# EAGLE board OSHintosh (EAGLE 9.7.0), part 1 of 5
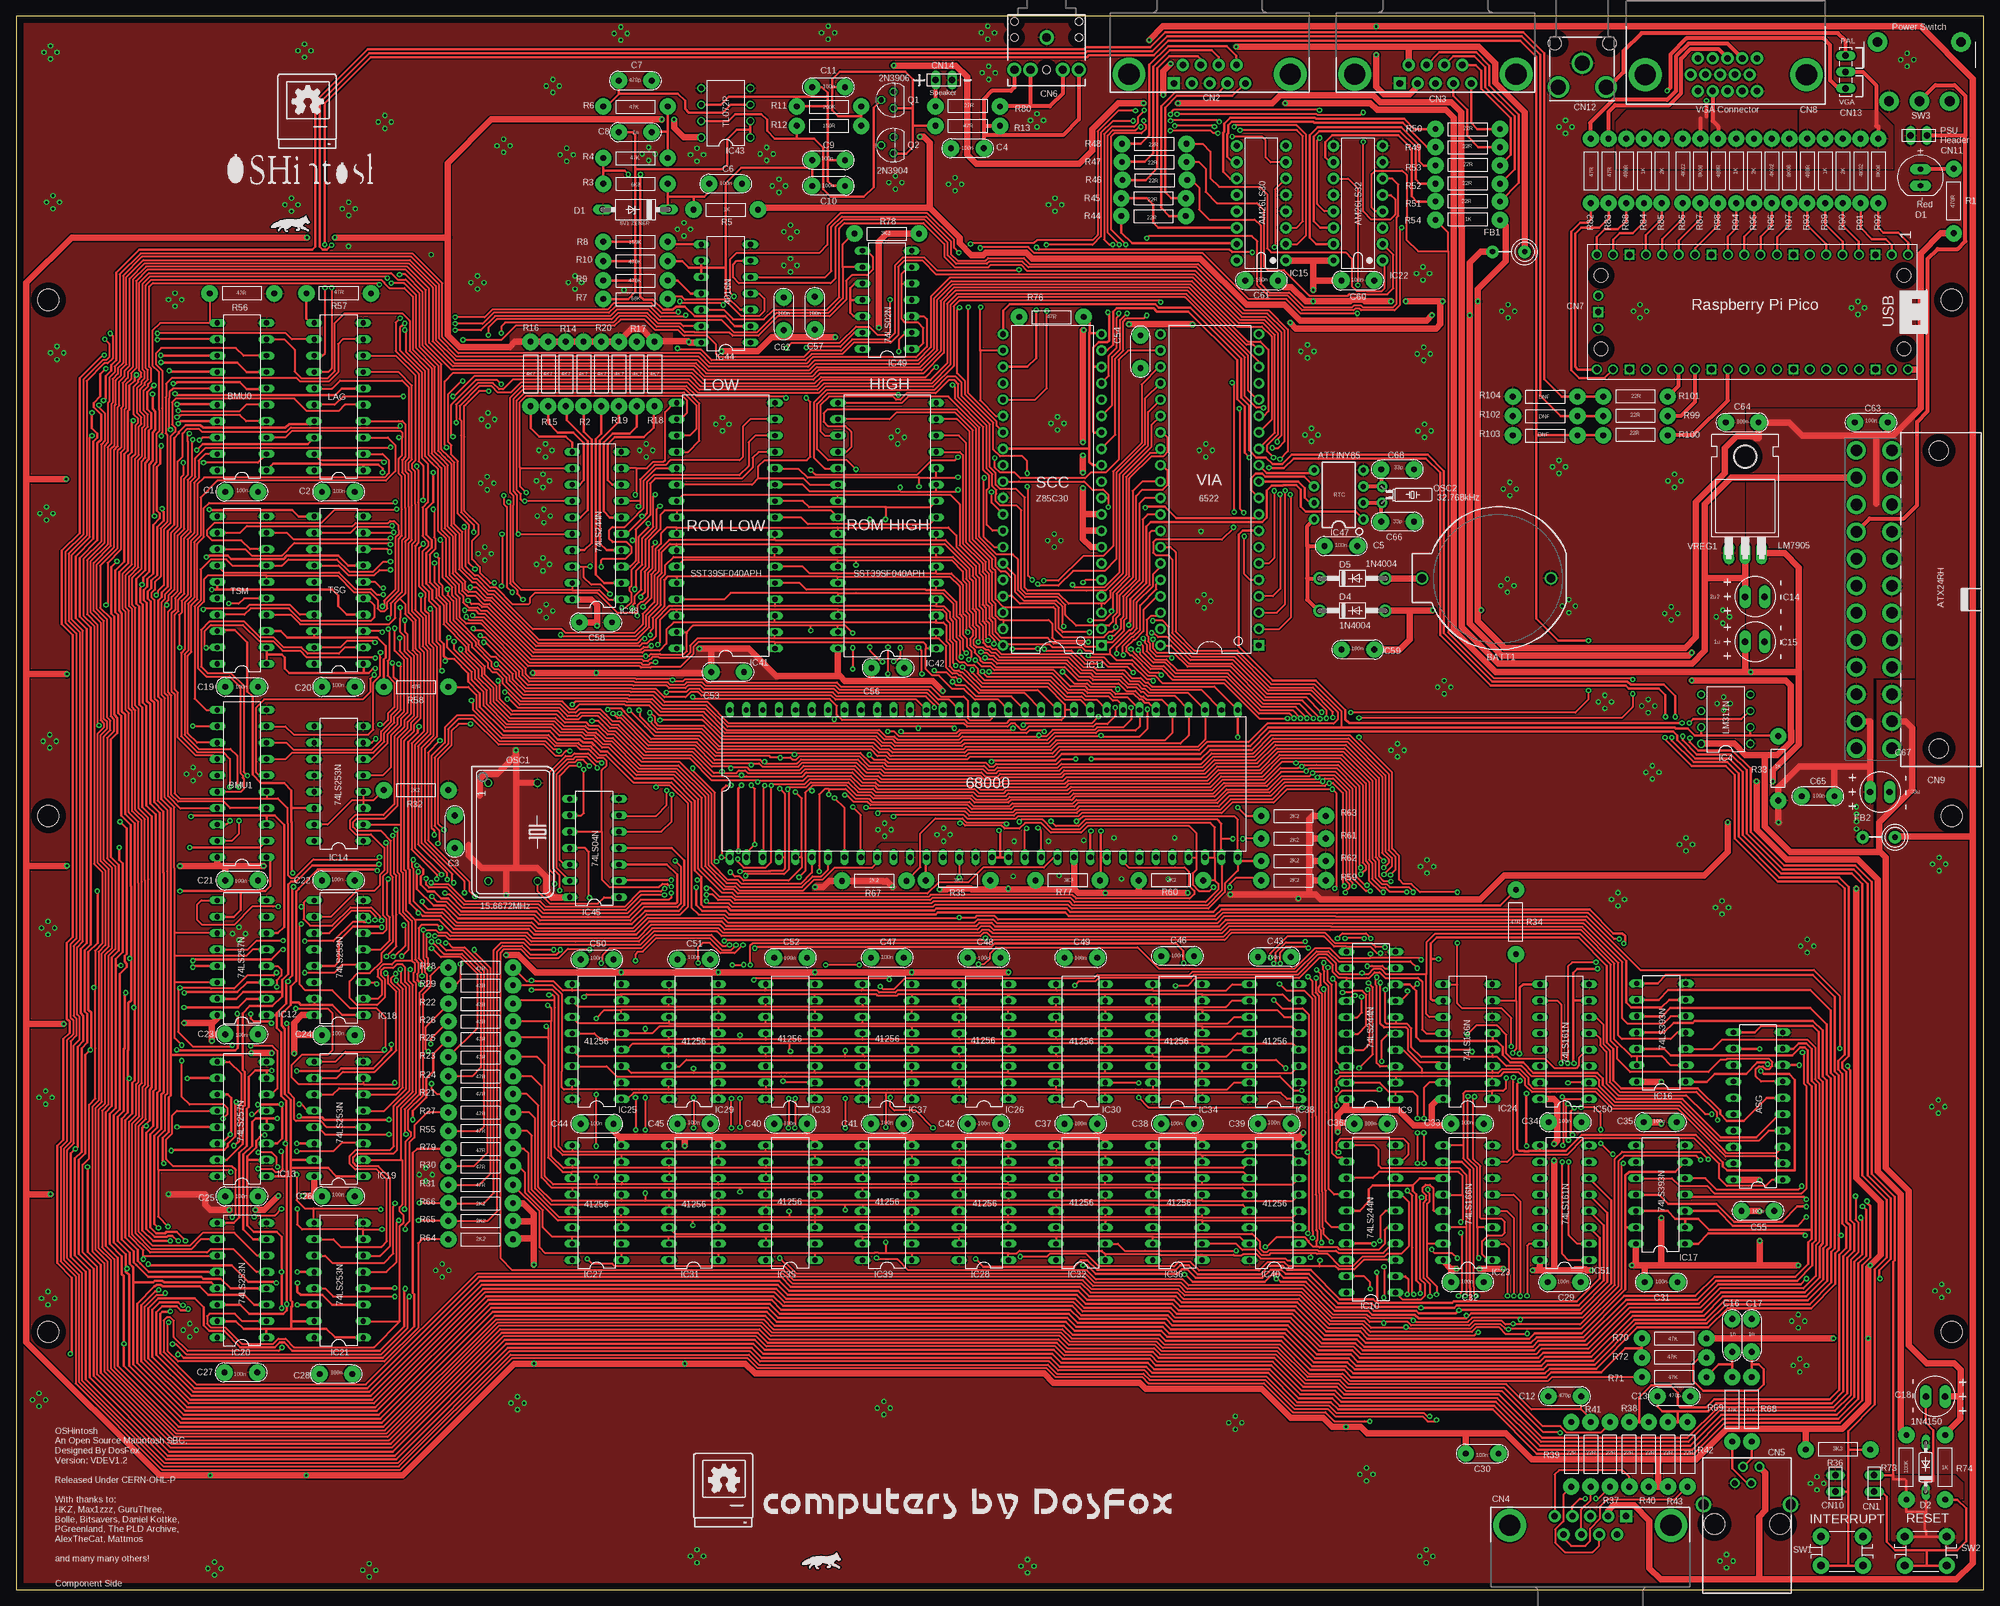
[diagram p5: board, top side]
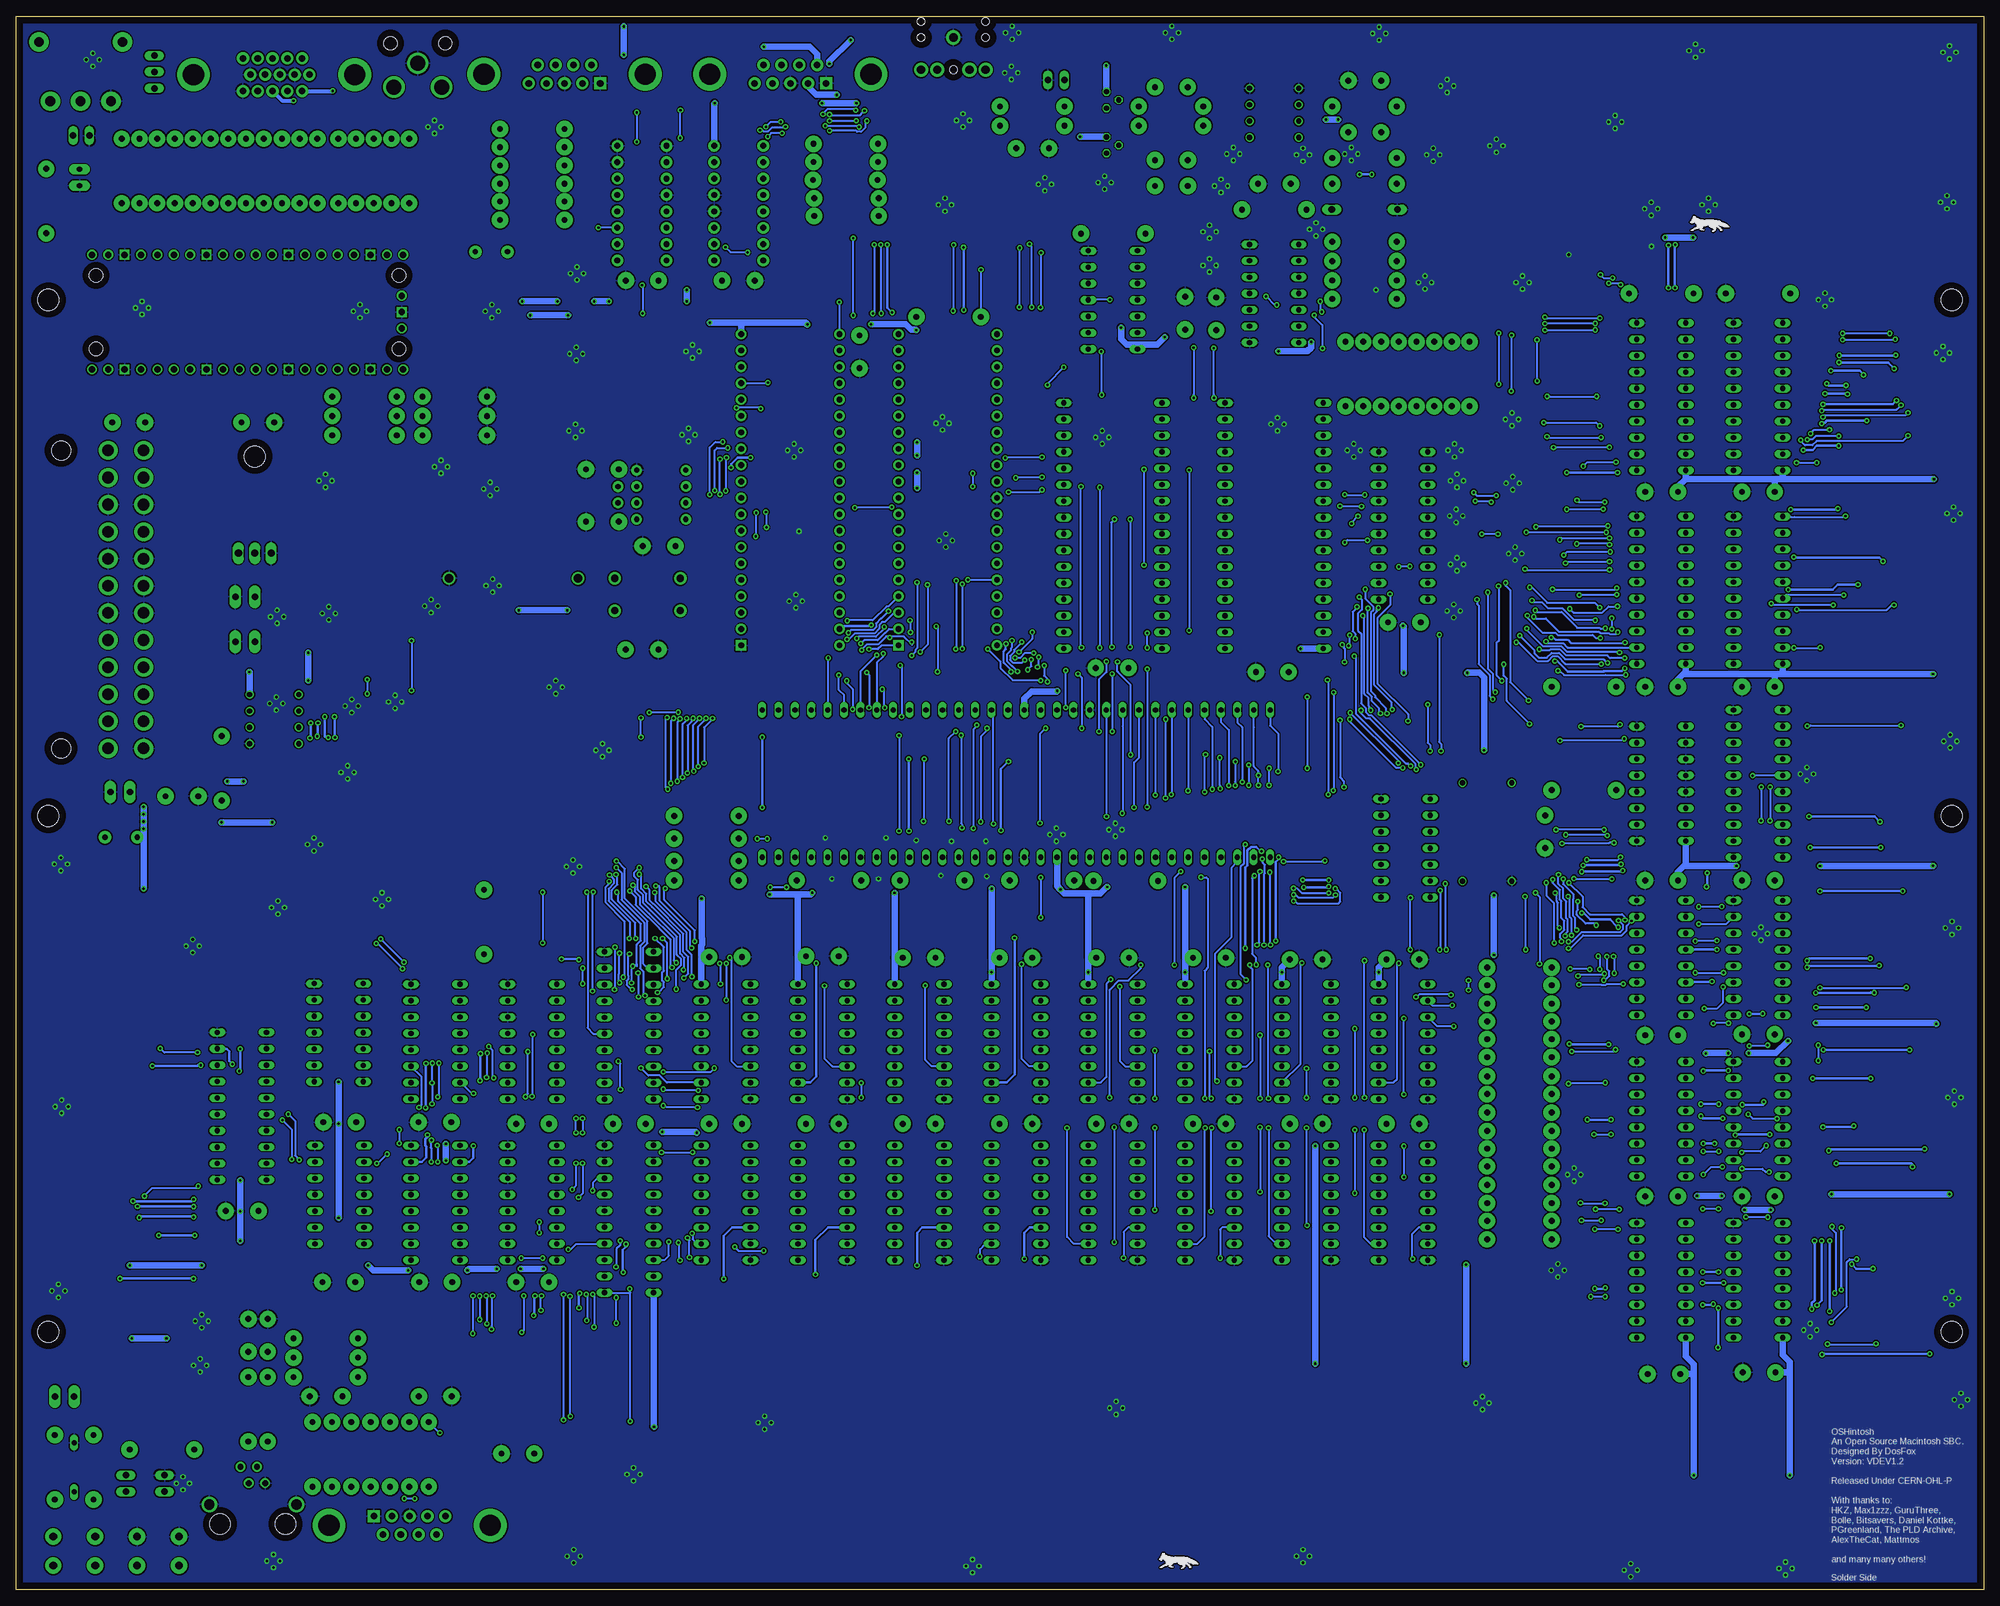
[diagram p6: board, bottom side, seen from below]

Size 305 x 244 mm. Coordinates in mm from the lower left corner, seen from the top.
Outline: 0,0 305,0 305,244 0,244 0,0
Copper layers (1*16): Top 0.035mm / dielectric 1.5mm / Bottom 0.035mm
Design rules "Fusion Electronics Design Rules *": minimum track width 0.2mm, minimum drill 0.25mm, track to track 8mil, track to pad 8mil, pad to pad 8mil, via to via 8mil, smd to smd 8mil, copper to edge 40mil, drill to drill 8mil, minimum pad ring 1mil, minimum via ring 8mil, stop-mask expansion 4mil, vias tented up to drill 1mm, thermal gap 10mil
Holes 3.3 mm at 5,200 5,120 5,40 300,40 300,120 300,200

## Footprints (pad centres in the part's own frame; a part is rotated, then mirrored left to right if it is on the bottom)
BATTCOM_20MM_PTH = drill 1.3: 1 11.85,0; 2 -8.15,0
CAP_5.08MM_PITCH = drill 0.9 pad 2.54: P$1 0,0; P$2 0,-5.08
CAP_ELECTROLYTIC = drill 1 pad 1.778 long: P$1 0,0; P$2 0,-3
2W_2.54MM_PITCH_VERT_TH = drill 1 pad 1.5 long: 1 -1.27,0; 2 1.27,0
DB9 = drill 1.016 pad 1.88 square: 1 -5.54,-1.42 | drill 1.016 pad 1.88: 2 -2.77,-1.42; 3 0,-1.42; 4 2.77,-1.42; 5 5.54,-1.42; 6 -4.15,1.42; 7 -1.38,1.42; 8 1.38,1.42; 9 4.15,1.42 | drill 3.302 pad 5.08: G1 -12.5,0; G2 12.5,0
XRJK-S-01-6-4-0-9M2 = drill 0.9 pad 1.5: 1 -1.905,6.35; 2 -0.635,8.89; 3 0.635,6.35; 4 1.905,8.89 | drill 1.6 pad 2.184: S1 -6.75,3.05; S2 6.75,3.05 | hole 3.2: -5.08,0; 5.08,0
AUDIO-JACK = drill 1.3 pad 2.184: RING 5,5; RSH 5,2.5; SLEEVE 0,0; TIP 5,-5; TSH 5,-2.5 | hole 1.2: 0,5; -2.5,5; -2.5,-5; 0,-5; 5,0
PICO_SOCKET = drill 1: P1 0,48.26; P2 0,45.72; P4 0,40.64; P5 0,38.1; P6 0,35.56; P7 0,33.02; P9 0,27.94; P10 0,25.4; P11 0,22.86; P12 0,20.32; P14 0,15.24; P15 0,12.7; P16 0,10.16; P17 0,7.62; P19 0,2.54; P20 0,0; P21 17.78,0; P22 17.78,2.54; P24 17.78,7.62; P25 17.78,10.16; P26 17.78,12.7; P27 17.78,15.24; P29 17.78,20.32; P30 17.78,22.86; P31 17.78,25.4; P32 17.78,27.94; P34 17.78,33.02; P35 17.78,35.56; P36 17.78,38.1; P37 17.78,40.64; P39 17.78,45.72; P40 17.78,48.26; P41 6.35,0.23; P43 11.43,0.23 | drill 1 square: P3 0,43.18; P8 0,30.48; P13 0,17.78; P18 0,5.08; P23 17.78,5.08; P28 17.78,17.78; P33 17.78,30.48; P38 17.78,43.18; P42 8.89,0.23 | hole 2.1: 3.19,0.63; 14.59,0.63; 14.59,47.63; 3.19,47.63
DB15 = drill 1.016 pad 1.88: 1 -4.32,-7.62; 2 -2.03,-7.62; 3 0.26,-7.62; 4 2.55,-7.62; 5 4.84,-7.62; 6 -5.46,-5.08; 7 -3.17,-5.08; 8 -0.88,-5.08; 9 1.41,-5.08; 10 3.7,-5.08; 11 -4.32,-2.54; 12 -2.03,-2.54; 13 0.26,-2.54; 14 2.55,-2.54; 15 4.84,-2.54 | drill 3.302 pad 5.08: G1 -12.5,-5.08; G2 12.5,-5.08
ATX24_RIGHT_ANGLE = drill 1.8 pad 2.9: 1 23.1,4.76; 2 18.9,4.76; 3 14.7,4.76; 4 10.5,4.76; 5 6.3,4.76; 6 2.1,4.76; 7 -2.1,4.76; 8 -6.3,4.76; 9 -10.5,4.76; 10 -14.7,4.76; 11 -18.9,4.76; 12 -23.1,4.76; 13 23.1,10.26; 14 18.9,10.26; 15 14.7,10.26; 16 10.5,10.26; 17 6.3,10.26; 18 2.1,10.26; 19 -2.1,10.26; 20 -6.3,10.26; 21 -10.5,10.26; 22 -14.7,10.26; 23 -18.9,10.26; 24 -23.1,10.26 | hole 3: -23.1,-2.54; 23.1,-2.54
RCA = drill 2.3: PIN 3.7,3.7; SHELL 0,0; SWITCH 3.7,-3.7 | hole 2.1: -3.1,4.25; -3.1,-4.25
3W_2.54MM_PITCH_VERT_TH = drill 1 long: 1 -2.54,0; 2 0,0; 3 2.54,0
F126Z10 = drill 1.016 long: A 5.08,0; C -5.08,0
DO35-7 = drill 0.813 long: A 3.81,0; C -3.81,0
5MM_TH_VERT_STANDARD = drill 0.8 pad 1.6 long: A 0,-1.27; C 0,1.27
DO41-10 = drill 1.118 pad 1.93: A 5.08,0; C -5.08,0
FB = drill 0.8 pad 1.93: P$1 -2.5,0; P$2 2.5,0
DIL64 = drill 0.813 long: 1 -39.37,-11.43; 2 -36.83,-11.43; 3 -34.29,-11.43; 4 -31.75,-11.43; 5 -29.21,-11.43; 6 -26.67,-11.43; 7 -24.13,-11.43; 8 -21.59,-11.43; 9 -19.05,-11.43; 10 -16.51,-11.43; 11 -13.97,-11.43; 12 -11.43,-11.43; 13 -8.89,-11.43; 14 -6.35,-11.43; 15 -3.81,-11.43; 16 -1.27,-11.43; 17 1.27,-11.43; 18 3.81,-11.43; 19 6.35,-11.43; 20 8.89,-11.43; 21 11.43,-11.43; 22 13.97,-11.43; 23 16.51,-11.43; 24 19.05,-11.43; 25 21.59,-11.43; 26 24.13,-11.43; 27 26.67,-11.43; 28 29.21,-11.43; 29 31.75,-11.43; 30 34.29,-11.43; 31 36.83,-11.43; 32 39.37,-11.43; 33 39.37,11.43; 34 36.83,11.43; 35 34.29,11.43; 36 31.75,11.43; 37 29.21,11.43; 38 26.67,11.43; 39 24.13,11.43; 40 21.59,11.43; 41 19.05,11.43; 42 16.51,11.43; 43 13.97,11.43; 44 11.43,11.43; 45 8.89,11.43; 46 6.35,11.43; 47 3.81,11.43; 48 1.27,11.43; 49 -1.27,11.43; 50 -3.81,11.43; 51 -6.35,11.43; 52 -8.89,11.43; 53 -11.43,11.43; 54 -13.97,11.43; 55 -16.51,11.43; 56 -19.05,11.43; 57 -21.59,11.43; 58 -24.13,11.43; 59 -26.67,11.43; 60 -29.21,11.43; 61 -31.75,11.43; 62 -34.29,11.43; 63 -36.83,11.43; 64 -39.37,11.43
DIL20 = drill 0.813 long: 1 -11.43,-3.81; 2 -8.89,-3.81; 3 -6.35,-3.81; 4 -3.81,-3.81; 5 -1.27,-3.81; 6 1.27,-3.81; 7 3.81,-3.81; 8 6.35,-3.81; 9 8.89,-3.81; 10 11.43,-3.81; 11 11.43,3.81; 12 8.89,3.81; 13 6.35,3.81; 14 3.81,3.81; 15 1.27,3.81; 16 -1.27,3.81; 17 -3.81,3.81; 18 -6.35,3.81; 19 -8.89,3.81; 20 -11.43,3.81
DIL08 = drill 0.813 pad 1.27: 1 -3.81,-3.81; 2 -1.27,-3.81; 3 1.27,-3.81; 4 3.81,-3.81; 5 3.81,3.81; 6 1.27,3.81; 7 -1.27,3.81; 8 -3.81,3.81
DIP40 = drill 0.889 pad 1.6 square: 1 -22.86,-7.62 | drill 0.889 pad 1.6: 2 -20.32,-7.62; 3 -17.78,-7.62; 4 -15.24,-7.62; 5 -12.7,-7.62; 6 -10.16,-7.62; 7 -7.62,-7.62; 8 -5.08,-7.62; 9 -2.54,-7.62; 10 0,-7.62; 11 2.54,-7.62; 12 5.08,-7.62; 13 7.62,-7.62; 14 10.16,-7.62; 15 12.7,-7.62; 16 15.24,-7.62; 17 17.78,-7.62; 18 20.32,-7.62; 19 22.86,-7.62; 20 25.4,-7.62; 21 25.4,7.62; 22 22.86,7.62; 23 20.32,7.62; 24 17.78,7.62; 25 15.24,7.62; 26 12.7,7.62; 27 10.16,7.62; 28 7.62,7.62; 29 5.08,7.62; 30 2.54,7.62; 31 0,7.62; 32 -2.54,7.62; 33 -5.08,7.62; 34 -7.62,7.62; 35 -10.16,7.62; 36 -12.7,7.62; 37 -15.24,7.62; 38 -17.78,7.62; 39 -20.32,7.62; 40 -22.86,7.62
DIL16 = drill 0.813 long: 1 -8.89,-3.81; 2 -6.35,-3.81; 3 -3.81,-3.81; 4 -1.27,-3.81; 5 1.27,-3.81; 6 3.81,-3.81; 7 6.35,-3.81; 8 8.89,-3.81; 9 8.89,3.81; 10 6.35,3.81; 11 3.81,3.81; 12 1.27,3.81; 13 -1.27,3.81; 14 -3.81,3.81; 15 -6.35,3.81; 16 -8.89,3.81
DIP16 = drill 0.9 pad 1.8: P$1 -8.89,-3.81; P$2 -6.35,-3.81; P$3 -3.81,-3.81; P$4 -1.27,-3.81; P$5 1.27,-3.81; P$6 3.81,-3.81; P$7 6.35,-3.81; P$8 8.89,-3.81; P$9 8.89,3.81; P$10 6.35,3.81; P$11 3.81,3.81; P$12 1.27,3.81; P$13 -1.27,3.81; P$14 -3.81,3.81; P$15 -6.35,3.81; P$16 -8.89,3.81
DIL14 = drill 0.813 long: 1 -7.62,-3.81; 2 -5.08,-3.81; 3 -2.54,-3.81; 4 0,-3.81; 5 2.54,-3.81; 6 5.08,-3.81; 7 7.62,-3.81; 8 7.62,3.81; 9 5.08,3.81; 10 2.54,3.81; 11 0,3.81; 12 -2.54,3.81; 13 -5.08,3.81; 14 -7.62,3.81
DIL32 = drill 0.813 long: 1 -19.05,-7.62; 2 -16.51,-7.62; 3 -13.97,-7.62; 4 -11.43,-7.62; 5 -8.89,-7.62; 6 -6.35,-7.62; 7 -3.81,-7.62; 8 -1.27,-7.62; 9 1.27,-7.62; 10 3.81,-7.62; 11 6.35,-7.62; 12 8.89,-7.62; 13 11.43,-7.62; 14 13.97,-7.62; 15 16.51,-7.62; 16 19.05,-7.62; 17 19.05,7.62; 18 16.51,7.62; 19 13.97,7.62; 20 11.43,7.62; 21 8.89,7.62; 22 6.35,7.62; 23 3.81,7.62; 24 1.27,7.62; 25 -1.27,7.62; 26 -3.81,7.62; 27 -6.35,7.62; 28 -8.89,7.62; 29 -11.43,7.62; 30 -13.97,7.62; 31 -16.51,7.62; 32 -19.05,7.62
DIP-40 = drill 0.889 pad 1.6 square: 1 -22.86,-7.62 | drill 0.889 pad 1.6: 2 -20.32,-7.62; 3 -17.78,-7.62; 4 -15.24,-7.62; 5 -12.7,-7.62; 6 -10.16,-7.62; 7 -7.62,-7.62; 8 -5.08,-7.62; 9 -2.54,-7.62; 10 0,-7.62; 11 2.54,-7.62; 12 5.08,-7.62; 13 7.62,-7.62; 14 10.16,-7.62; 15 12.7,-7.62; 16 15.24,-7.62; 17 17.78,-7.62; 18 20.32,-7.62; 19 22.86,-7.62; 20 25.4,-7.62; 21 25.4,7.62; 22 22.86,7.62; 23 20.32,7.62; 24 17.78,7.62; 25 15.24,7.62; 26 12.7,7.62; 27 10.16,7.62; 28 7.62,7.62; 29 5.08,7.62; 30 2.54,7.62; 31 0,7.62; 32 -2.54,7.62; 33 -5.08,7.62; 34 -7.62,7.62; 35 -10.16,7.62; 36 -12.7,7.62; 37 -15.24,7.62; 38 -17.78,7.62; 39 -20.32,7.62; 40 -22.86,7.62
DIP08_MCU = drill 0.813 pad 1.626: 1 -3.81,-3.81; 2 -1.27,-3.81; 3 1.27,-3.81; 4 3.81,-3.81; 5 3.81,3.81; 6 1.27,3.81; 7 -1.27,3.81; 8 -3.81,3.81
DIL14S = drill 0.813: 1 -7.62,-3.81; 7 7.62,-3.81; 8 7.62,3.81; 14 -7.62,3.81
CRYSTAL-PTH-2X6-CYL = drill 0.813 pad 1.676: 1 -1.27,0; 2 1.27,0
TO92 = drill 0.813 octagon: 1 1.27,0; 2 0,1.905; 3 -1.27,0
TO92D = drill 0.813 octagon: B 0,1.905; C 1.27,0; E -1.27,0
RESISTORTHRUHOLE = drill 0.9 pad 2.54: P$1 0,0; P$2 10,0
DIP_DTS_6_TACT_SWITCH_6X6_TH = drill 1.2 pad 2.54: P$1 -3.25,2.25; P$2 3.25,2.25; P$3 -3.25,-2.25; P$4 3.25,-2.25
THRUHOLE90DEGSLIDESW = drill 1.5 pad 3: P$1 -4.7,-4.2; P$2 0,-4.2; P$3 4.7,-4.2; P$4 -6.475,5; P$5 6.475,5
TO220H = drill 1.118 long: 1 -2.54,-10.16; 2 0,-10.16; 3 2.54,-10.16 | hole 3.302: 0,4.826

## Placement (x,y rotation side)
A1  VDEV1  [PCB_CUSTOM_DETAILS]  323.52,1.23 0 top  (outside the outline)
BATT1  [BATTCOM_20MM_PTH]  229.74,156.84 180 top
C1  100n 50V  [CAP_5.08MM_PITCH]  37.5,170.25 270 top
C2  100n 50V  [CAP_5.08MM_PITCH]  52.5,170.25 270 top
C3  100n 50V  [CAP_5.08MM_PITCH]  68,115 180 top
C4  100n 50V  [CAP_5.08MM_PITCH]  150,223.5 270 top
C5  100n 50V  [CAP_5.08MM_PITCH]  207.89,161.83 270 top
C6  100n 50V  [CAP_5.08MM_PITCH]  112.5,218 270 top
C7  470p 50V  [CAP_5.08MM_PITCH]  98.5,234 270 top
C8  1n 50V  [CAP_5.08MM_PITCH]  98.5,226 270 top
C9  100n 50V  [CAP_5.08MM_PITCH]  123.38,221.68 90 top
C10  100n 50V  [CAP_5.08MM_PITCH]  123.38,217.68 90 top
C11  220p 50V  [CAP_5.08MM_PITCH]  123.4,233 90 top
C12  470p 50V  [CAP_5.08MM_PITCH]  237.5,30 90 top
C13  470p 50V  [CAP_5.08MM_PITCH]  259.5,30 270 top
C14  2u2 50V  [CAP_ELECTROLYTIC]  268,154 90 top
C15  1u 50V  [CAP_ELECTROLYTIC]  268,147 90 top
C16  1n 50V  [CAP_5.08MM_PITCH]  266,42 0 top
C17  1n 50V  [CAP_5.08MM_PITCH]  269,42 0 top
C18  4u7 50V  [CAP_ELECTROLYTIC]  299,30 270 top
C19  100n 50V  [CAP_5.08MM_PITCH]  37.5,140 270 top
C20  100n 50V  [CAP_5.08MM_PITCH]  52.5,140 270 top
C21  100n 50V  [CAP_5.08MM_PITCH]  37.5,110 270 top
C22  100n 50V  [CAP_5.08MM_PITCH]  52.5,110 270 top
C23  100n 50V  [CAP_5.08MM_PITCH]  37.5,86.13 270 top
C24  100n 50V  [CAP_5.08MM_PITCH]  52.5,86 270 top
C25  100n 50V  [CAP_5.08MM_PITCH]  37.5,61 270 top
C26  100n 50V  [CAP_5.08MM_PITCH]  52.5,61 270 top
C27  100n 50V  [CAP_5.08MM_PITCH]  37.37,33.71 270 top
C28  100n 50V  [CAP_5.08MM_PITCH]  52.12,33.46 270 top
C29  100n 50V  [CAP_5.08MM_PITCH]  242.5,47.7 270 top
C30  100n 50V  [CAP_5.08MM_PITCH]  229.77,21.13 270 top
C31  100n 50V  [CAP_5.08MM_PITCH]  257.5,47.7 270 top
C32  100n 50V  [CAP_5.08MM_PITCH]  227.5,47.7 270 top
C33  100n 50V  [CAP_5.08MM_PITCH]  227.5,72.25 270 top
C34  100n 50V  [CAP_5.08MM_PITCH]  242.63,72.51 270 top
C35  100n 50V  [CAP_5.08MM_PITCH]  257.37,72.51 270 top
C36  100n 50V  [CAP_5.08MM_PITCH]  212.5,72.25 270 top
C37  100n 50V  [CAP_5.08MM_PITCH]  162.5,72.25 90 top
C38  100n 50V  [CAP_5.08MM_PITCH]  177.5,72.25 90 top
C39  100n 50V  [CAP_5.08MM_PITCH]  192.5,72.25 90 top
C40  100n 50V  [CAP_5.08MM_PITCH]  117.5,72.25 90 top
C41  100n 50V  [CAP_5.08MM_PITCH]  132.5,72.25 90 top
C42  100n 50V  [CAP_5.08MM_PITCH]  147.5,72.25 90 top
C43  100n 50V  [CAP_5.08MM_PITCH]  192.5,98.13 90 top
C44  100n 50V  [CAP_5.08MM_PITCH]  87.5,72.25 90 top
C45  100n 50V  [CAP_5.08MM_PITCH]  102.5,72.25 90 top
C46  100n 50V  [CAP_5.08MM_PITCH]  177.5,98.25 90 top
C47  100n 50V  [CAP_5.08MM_PITCH]  132.5,98 90 top
C48  100n 50V  [CAP_5.08MM_PITCH]  147.5,98 90 top
C49  100n 50V  [CAP_5.08MM_PITCH]  162.5,98 90 top
C50  100n 50V  [CAP_5.08MM_PITCH]  87.5,97.75 90 top
C51  100n 50V  [CAP_5.08MM_PITCH]  102.5,97.75 90 top
C52  100n 50V  [CAP_5.08MM_PITCH]  117.5,98 90 top
C53  100n 50V  [CAP_5.08MM_PITCH]  112.83,142.3 270 top
C54  100n 50V  [CAP_5.08MM_PITCH]  174.27,189.41 180 top
C55  100n 50V  [CAP_5.08MM_PITCH]  272.5,58.74 270 top
C56  100n 50V  [CAP_5.08MM_PITCH]  137.66,142.94 270 top
C57  100n 50V  [CAP_5.08MM_PITCH]  123.8,200.49 0 top
C58  100n 50V  [CAP_5.08MM_PITCH]  92.37,150 270 top
C59  100n 50V  [CAP_5.08MM_PITCH]  205.45,145.79 90 top
C60  100n 50V  [CAP_5.08MM_PITCH]  210.5,203 270 top
C61  100n 50V  [CAP_5.08MM_PITCH]  190.5,203 90 top
C62  100n 50V  [CAP_5.08MM_PITCH]  118.97,200.38 0 top
C63  100n 50V  [CAP_5.08MM_PITCH]  285,181 90 top
C64  100n 50V  [CAP_5.08MM_PITCH]  265,181 90 top
C65  100n 50V  [CAP_5.08MM_PITCH]  276.76,123.06 90 top
C66  33p  [CAP_5.08MM_PITCH]  211.58,165.61 90 top
C67  33u 16V  [CAP_ELECTROLYTIC]  287.38,123.7 90 top
C68  33p  [CAP_5.08MM_PITCH]  211.58,173.74 90 top
CN1  2way  [2W_2.54MM_PITCH_VERT_TH]  288,16.5 90 top
CN2  [DB9]  185,235 0 top
CN3  [DB9]  220,235 0 top
CN4  [DB9]  244,10 180 top
CN5  XRJK-S-01-6-4-0-9M2  [XRJK-S-01-6-4-0-9M2]  268.31,10.19 0 top
CN6  AUDIO_JACK_3.5MM_PTH  [AUDIO-JACK]  159.73,240.69 270 top
CN7  V06-1x20-SV-GF-1  [PICO_SOCKET]  245,207 270 top
CN8  DB15  [DB15]  265,240 0 top
CN9  ATX24RH  [ATX24_RIGHT_ANGLE]  295.49,153.56 90 top
CN10  2way  [2W_2.54MM_PITCH_VERT_TH]  282,16.5 90 top
CN11  2way  [2W_2.54MM_PITCH_VERT_TH]  294.91,225.48 0 top
CN12  RCA  [RCA]  242.75,236.7 270 top
CN13  V06-1x3-SV-GF-1  [3W_2.54MM_PITCH_VERT_TH]  283.58,235.34 90 top
CN14  2way  [2W_2.54MM_PITCH_VERT_TH]  143.8,234.1 180 top
D1  [F126Z10]  96,214 180 top
D2  1N4150  [DO35-7]  296,19 90 top
D3  Red  [5MM_TH_VERT_STANDARD]  295.17,218.97 180 top
D4  1N4004  [DO41-10]  207.13,151.83 0 top
D5  1N4004  [DO41-10]  207.13,156.83 0 top
FB1  FB  [FB]  231.33,207.46 0 top
FB2  FB  [FB]  288.72,116.69 0 top
IC1  [DIL64]  150,125 0 top
IC2  TSM  [DIL20]  35,155 90 top
IC3  LAG  [DIL20]  50,185 90 top
IC4  LM311N  [DIL08]  265,135 90 top
IC5  TSG  [DIL20]  50,155 90 top
IC6  ASG  [DIL20]  270,75 90 top
IC7  BMU0  [DIL20]  35,185 90 top
IC8  BMU1  [DIL20]  35,125 90 top
IC9  74LS244N  [DIL20]  210,87.49 90 top
IC10  74LS244N  [DIL20]  210,57.5 90 top
IC11  Z85C30  [DIP40]  160.6,169.3 90 top
IC12  74LS257N  [DIL16]  35,98 90 top
IC13  74LS257N  [DIL16]  35,73 90 top
IC14  74LS253N  [DIL16]  50,125 90 top
IC15  AM26LS30  [DIP16]  193,215 90 top
IC16  74LS393N  [DIL14]  255,86.4 90 top
IC17  74LS393N  [DIL14]  254.87,61.27 90 top
IC18  74LS253N  [DIL16]  50,98 90 top
IC19  74LS253N  [DIL16]  50,73 90 top
IC20  74LS253N  [DIL16]  35,48 90 top
IC21  74LS253N  [DIL16]  50,48 90 top
IC22  AM26LS32  [DIP16]  208,215 90 top
IC23  74LS166N  [DIL16]  225,60 90 top
IC24  74LS166N  [DIL16]  225,85 90 top
IC25  [DIL16]  90,85 90 top
IC26  [DIL16]  150,85 90 top
IC27  [DIL16]  90,60 90 top
IC28  [DIL16]  150,60 90 top
IC29  [DIL16]  105,85 90 top
IC30  [DIL16]  165,85 90 top
IC31  [DIL16]  105,60 90 top
IC32  [DIL16]  165,60 90 top
IC33  [DIL16]  120,85 90 top
IC34  [DIL16]  180,85 90 top
IC35  [DIL16]  120,60 90 top
IC36  [DIL16]  180,60 90 top
IC37  [DIL16]  135,85 90 top
IC38  [DIL16]  195,85 90 top
IC39  [DIL16]  135,60 90 top
IC40  [DIL16]  195,60 90 top
IC41  SST39SF040APH  [DIL32]  110,165 90 top
IC42  SST39SF040APH  [DIL32]  135,165 90 top
IC43  TL072P  [DIL08]  110,229 90 top
IC44  4016N  [DIL14]  110,201 90 top
IC45  74LS04N  [DIL14]  89.62,115 90 top
IC46  6522  [DIP-40]  185,169.3 90 top
IC47  ATTINY85  [DIP08_MCU]  205,169.8 90 top
IC48  74LS244N  [DIL20]  90,165 90 top
IC49  74LS02N  [DIL14]  135,200 90 top
IC50  74LS161N  [DIL16]  240,85 90 top
IC51  74LS161N  [DIL16]  240,60 90 top
OSC1  15.6672MHz  [DIL14S]  77,117.5 270 top
OSC2  32.768kHz  [CRYSTAL-PTH-2X6-CYL]  211.71,169.8 270 top
Q1  2N3906  [TO92]  136,231 90 top
Q2  2N3904  [TO92D]  136,224 90 top
R1  470R  [RESISTORTHRUHOLE]  300.33,220.32 270 top
R2  4k7  [RESISTORTHRUHOLE]  87.94,183.51 90 top
R3  6k8  [RESISTORTHRUHOLE]  91,218 0 top
R4  47k  [RESISTORTHRUHOLE]  91,222 0 top
R5  1k  [RESISTORTHRUHOLE]  105,214 0 top
R6  47k  [RESISTORTHRUHOLE]  91,230 0 top
R7  68k  [RESISTORTHRUHOLE]  91,200.14 0 top
R8  150k  [RESISTORTHRUHOLE]  91,209.02 0 top
R9  470k  [RESISTORTHRUHOLE]  91,203.02 0 top
R10  470k  [RESISTORTHRUHOLE]  91,206.02 0 top
R11  200k  [RESISTORTHRUHOLE]  121,230 0 top
R12  150R  [RESISTORTHRUHOLE]  121,227 0 top
R13  27R  [RESISTORTHRUHOLE]  152.5,230 180 top
R14  4k7  [RESISTORTHRUHOLE]  85.2,183.51 90 top
R15  4k7  [RESISTORTHRUHOLE]  82.46,183.51 90 top
R16  4k7  [RESISTORTHRUHOLE]  79.71,183.51 90 top
R17  4k7  [RESISTORTHRUHOLE]  98.93,183.51 90 top
R18  4k7  [RESISTORTHRUHOLE]  96.19,183.51 90 top
R19  4k7  [RESISTORTHRUHOLE]  93.43,183.51 90 top
R20  4k7  [RESISTORTHRUHOLE]  90.69,183.51 90 top
R21  47R  [RESISTORTHRUHOLE]  67,76.88 0 top
R22  47R  [RESISTORTHRUHOLE]  67,90.87 0 top
R23  47R  [RESISTORTHRUHOLE]  67,82.59 0 top
R24  47R  [RESISTORTHRUHOLE]  67,79.62 0 top
R25  47R  [RESISTORTHRUHOLE]  67,85.39 0 top
R26  47R  [RESISTORTHRUHOLE]  67,88.13 0 top
R27  47R  [RESISTORTHRUHOLE]  67,74.01 0 top
R28  47R  [RESISTORTHRUHOLE]  67,96.49 0 top
R29  47R  [RESISTORTHRUHOLE]  67,93.74 0 top
R30  47R  [RESISTORTHRUHOLE]  67,65.66 0 top
R31  47R  [RESISTORTHRUHOLE]  67,62.79 0 top
R32  2k2  [RESISTORTHRUHOLE]  57,124 0 top
R33  1k  [RESISTORTHRUHOLE]  273.13,132.37 270 top
R34  47R  [RESISTORTHRUHOLE]  232.48,108.55 270 top
R35  3k3  [RESISTORTHRUHOLE]  141,110 0 top
R36  3k3  [RESISTORTHRUHOLE]  287.4,21.74 180 top
R37  22R  [RESISTORTHRUHOLE]  247.05,26 270 top
R38  22R  [RESISTORTHRUHOLE]  250.05,26 270 top
R39  22R  [RESISTORTHRUHOLE]  241.05,16 90 top
R40  3k3  [RESISTORTHRUHOLE]  253.05,26 270 top
R41  22R  [RESISTORTHRUHOLE]  244.05,16 90 top
R42  22R  [RESISTORTHRUHOLE]  259.05,16 90 top
R43  3k3  [RESISTORTHRUHOLE]  256.05,26 270 top
R44  22R  [RESISTORTHRUHOLE]  171.3,213.01 0 top
R45  22R  [RESISTORTHRUHOLE]  171.3,215.76 0 top
R46  22R  [RESISTORTHRUHOLE]  171.5,218.6 0 top
R47  22R  [RESISTORTHRUHOLE]  171.4,221.4 0 top
R48  22R  [RESISTORTHRUHOLE]  171.4,224.2 0 top
R49  22R  [RESISTORTHRUHOLE]  220,223.7 0 top
R50  22R  [RESISTORTHRUHOLE]  220,226.5 0 top
R51  22R  [RESISTORTHRUHOLE]  230,215.26 180 top
R52  22R  [RESISTORTHRUHOLE]  230,218 180 top
R53  22R  [RESISTORTHRUHOLE]  230,220.84 180 top
R54  1k  [RESISTORTHRUHOLE]  230,212.4 180 top
R55  47R  [RESISTORTHRUHOLE]  67,71.14 0 top
R56  47R  [RESISTORTHRUHOLE]  40,201 180 top
R57  47R  [RESISTORTHRUHOLE]  55,201 180 top
R58  47R  [RESISTORTHRUHOLE]  57,140 0 top
R59  2k2  [RESISTORTHRUHOLE]  193,110 0 top
R60  2k2  [RESISTORTHRUHOLE]  184,110 180 top
R61  2k2  [RESISTORTHRUHOLE]  193,116.48 0 top
R62  2k2  [RESISTORTHRUHOLE]  193,113 0 top
R63  2k2  [RESISTORTHRUHOLE]  193,120 0 top
R64  2k2  [RESISTORTHRUHOLE]  67,54.34 0 top
R65  2k2  [RESISTORTHRUHOLE]  67,57.21 0 top
R66  2k2  [RESISTORTHRUHOLE]  67,59.95 0 top
R67  2k2  [RESISTORTHRUHOLE]  138.01,109.93 180 top
R68  22R  [RESISTORTHRUHOLE]  269,33 270 top
R69  22R  [RESISTORTHRUHOLE]  266,33 270 top
R70  47k  [RESISTORTHRUHOLE]  252,39 0 top
R71  680R  [RESISTORTHRUHOLE]  262,36 180 top
R72  75R  [RESISTORTHRUHOLE]  252,33 0 top
R73  100k  [RESISTORTHRUHOLE]  293,24 270 top
R74  1k  [RESISTORTHRUHOLE]  299,24 270 top
R76  47R  [RESISTORTHRUHOLE]  155.47,197.37 0 top
R77  3k3  [RESISTORTHRUHOLE]  168,110 180 top
R78  3k3  [RESISTORTHRUHOLE]  129.96,210.29 0 top
R79  47R  [RESISTORTHRUHOLE]  67,68.4 0 top
R80  47R  [RESISTORTHRUHOLE]  142.5,227 0 top
R82  47R  [RESISTORTHRUHOLE]  244.08,215 90 top
R83  47R  [RESISTORTHRUHOLE]  246.83,215 90 top
R84  1k  [RESISTORTHRUHOLE]  252.31,215 90 top
R85  2k  [RESISTORTHRUHOLE]  255.06,215 90 top
R86  4k02  [RESISTORTHRUHOLE]  258.31,215 90 top
R87  8k06  [RESISTORTHRUHOLE]  261.06,215 90 top
R88  499R  [RESISTORTHRUHOLE]  249.57,215 90 top
R89  1k  [RESISTORTHRUHOLE]  280.4,215 90 top
R90  2k  [RESISTORTHRUHOLE]  283.14,215 90 top
R91  4k02  [RESISTORTHRUHOLE]  285.89,215 90 top
R92  8k06  [RESISTORTHRUHOLE]  288.63,215 90 top
R93  499R  [RESISTORTHRUHOLE]  277.6,215 90 top
R94  1k  [RESISTORTHRUHOLE]  266.63,215 90 top
R95  2k  [RESISTORTHRUHOLE]  269.37,215 90 top
R96  4k02  [RESISTORTHRUHOLE]  272.11,215 90 top
R97  8k06  [RESISTORTHRUHOLE]  274.86,215 90 top
R98  499R  [RESISTORTHRUHOLE]  263.8,215 90 top
R99  22R  [RESISTORTHRUHOLE]  256,182 180 top
R100  22R  [RESISTORTHRUHOLE]  256,179 180 top
R101  22R  [RESISTORTHRUHOLE]  256,185 180 top
R102  DNF  [RESISTORTHRUHOLE]  232,182 0 top
R103  DNF  [RESISTORTHRUHOLE]  232,179 0 top
R104  DNF  [RESISTORTHRUHOLE]  232,185 0 top
SW1  DTS-61  [DIP_DTS_6_TACT_SWITCH_6X6_TH]  283,6 0 top
SW2  DTS-61  [DIP_DTS_6_TACT_SWITCH_6X6_TH]  296,6 0 top
SW3  SS12D16-GDN5  [THRUHOLE90DEGSLIDESW]  295,235 0 top
VREG1  LM7905  [TO220H]  268,170.89 0 top

## Tracks (layer width: path | path; a pad name or v marks a point on that pad's centre or on a via)
!A20  (via drill 0.35 pad 0.8)
  Top 0.305: IC46.24 174.96,184.66 174.96,177.61 170.53,173.19 170.53,159.82 168.7,157.98 163.83,157.98 161.54,155.7 158.62,155.7 v158.37,155.95 | v158.37,145.92 158.32,145.87 v154.38,145.87 | v142.32,136.8 142.32,137.19 141,138.51 127.22,138.51 126.59,139.15 106.45,139.15 105.91,139.69 104.35,139.69 103.87,139.21 100.86,139.21 v100.79,139.14 | IC45.6 93.49,120.02 99.19,120.02 100.84,121.67 v100.84,123.94 | v142.32,142.52 142.57,142.27 144.2,142.27 144.92,141.55 145.62,141.55 v146.19,140.98 | v100.84,123.94
  Bottom 0.305: v142.32,136.8 142.32,142.06 v142.32,142.52 | v158.37,155.95 v158.37,145.92 | v146.19,140.98 146.24,141.03 150.55,141.03 152.46,142.94 152.46,143.95 v154.38,145.87 | v100.79,139.14 100.79,124.17 100.84,124.12 v100.84,123.94
!AS  (via drill 0.35 pad 0.8)
  Top 0.305: IC8.11 29.43,136.43 27.67,138.19 27.67,152.47 28.6,153.4 28.6,158.19 30.18,159.78 32.58,159.78 33.6,158.76 38.76,158.76 IC2.7 41.22,158.81 42.19,159.78 49.73,159.78 51.66,157.84 55.33,157.84 56.9,159.41 v58.03,159.41 | IC1.6 123.33,111.2 121.59,109.47 112.49,109.47 111.86,110.09 110.33,110.09 107.8,112.62 107.8,123.41 102.85,128.35 96.96,128.35 92.72,132.6 91.67,132.6 90.65,133.62 90.64,133.62 90.3,133.96 88.94,133.96 88.44,134.47 85.06,134.47 83.81,135.71 76.71,135.71 74.49,137.94 74.49,140.08 72.66,141.91 72.66,143.18 70.19,145.64 70.19,146.5 66.75,149.94 66.75,152.89 65.59,154.05 65.59,155.46 64.86,156.18 v64.86,159.2 v64.86,159.21
  Bottom 0.305: v58.03,159.41 64.56,159.41 64.76,159.21 v64.86,159.21
!C16M
  Top 0.305: IC45.1 91.14,107.38 90.18,106.42 82.74,106.42 80.79,108.36 80.81,109.12 OSC1.8
!DMA  (via drill 0.35 pad 0.8)
  Top 0.406: IC12.15 34.15,91.65 35.17,92.67 41.09,92.67 41.22,92.53 | IC13.15 31.21,66.67 32.67,66.67 35.11,69.11 35.11,74.79 35.44,75.12 35.44,80.28 35.1,80.63 35.1,82.91 | 35.1,82.91 24,82.91 | IC3.17 45.77,180.77 42.34,180.77 41.74,180.17 28.98,180.17 28.57,180.58 26.31,180.58 25.23,179.5 25.23,179.32 24.48,178.57 24.48,165.14 23.47,164.13 23.47,155.53 22.54,154.6 22.54,153.9 22,153.35 22,138.52 22.49,138.03 22.49,122.61 23.96,121.14 23.96,111.68 24,111.64 24,82.91 | v283.88,81.24 284.07,81.04 284.07,80.76 284.3,80.53 284.3,57.34 284.91,56.73 284.91,52.54 283.82,51.45 283.82,30.5 281.66,28.33 263.79,28.33 259.01,23.55 236.57,23.55 229.84,30.29 205.88,30.29 204.73,31.44 199.52,31.44 195.01,35.95 177.1,35.95 176.14,36.91 162.72,36.91 161.32,38.31 116.53,38.31 114.98,39.85 75.25,39.85 58.03,22.64 24.14,22.64 13.13,33.65 13.13,50.39 11.12,52.41 11.12,65.53 v11.06,65.59 | IC6.8 v276.37,81.35 | 35.1,82.91 35.1,89.38 36.22,90.5 39.71,90.5 41.22,92.02 41.22,92.53 | 41.22,92.53 41.22,94.53 42.19,95.5 42.19,100.99 42.18,101 42.18,109.35 42.66,109.82 43.43,109.82 45.92,112.31 56.05,112.31 v56.25,112.51 | 24,82.91 24,76.69 23.62,76.31 23.62,70.97 22.73,70.08 22.73,66.11 v22.87,66.11 | IC45.3 100.88,112.46 102.46,110.88 102.46,106.61 102.26,106.41 97.04,106.41 94.96,104.33 81.44,104.33 80.6,105.17 69,105.17 66.95,107.22 65.87,107.22 64.78,108.31 63.77,108.31 62.74,109.35 62.74,110.61 63.12,110.99 63.12,111.66 62.45,112.33 v62.12,112.33
  Bottom 0.406: v283.88,81.24 276.89,81.24 276.78,81.35 v276.37,81.35 | v22.87,66.11 11.23,66.11 11.1,65.97 11.1,65.63 v11.06,65.59 | v56.25,112.51 56.4,112.36 62.09,112.36 v62.12,112.33
!DMALD  (via drill 0.35 pad 0.8)
  Top 0.406: v270.26,83.88 270.25,83.89 IC6.12 | IC50.9 233.59,93.89 233.06,93.36 233.06,83.66 233.03,83.62 v233.03,83.13 | 236.19,68.03 IC51.9 | v233.1,78.93 232.64,78.47 232.64,68.35 232.96,68.03 233.77,68.03 233.79,68.01 234.46,68.01 234.47,68.03 236.19,68.03 | 236.19,68.03 240.18,68.03 242.67,70.52 260.35,70.52 264.56,66.31 264.56,65.69 265.23,65.02 275.72,65.02 275.72,79.06 274.82,79.96 270.9,79.96 v270.42,80.43
  Bottom 0.406: v233.03,83.13 233.03,79.13 233.1,79.06 v233.1,78.93 | v270.42,80.43 270.26,80.6 v270.26,83.88
!DTACK  (via drill 0.35 pad 0.8)
  Top 0.305: IC7.19 29.33,176.11 28.29,175.06 28.29,172.35 27.58,171.64 27.58,163.86 26.57,162.84 26.57,154.24 25.64,153.32 25.64,151.52 25.27,151.16 25.27,146.17 v25.34,146.1 | 29.21,146.11 IC2.19 | v55.67,144.46 55.49,144.64 44.97,144.64 44.01,145.6 41.29,145.6 39.82,147.07 37.69,147.07 35.15,149.62 30.18,149.62 29.21,148.65 29.21,146.11 | 29.21,146.11 29.27,146.05 v29.45,146.05 | IC1.10 133.49,112.78 132.71,112 126.88,112 124.99,110.11 123.67,110.11 122.02,108.45 112.07,108.45 111.44,109.07 109.91,109.07 106.78,112.2 106.78,122.99 102.43,127.34 96.54,127.34 92.3,131.58 91.25,131.58 90.23,132.6 90.22,132.6 89.88,132.94 88.52,132.94 88.02,133.45 84.64,133.45 83.39,134.7 76.29,134.7 73.47,137.52 73.47,139.66 71.64,141.49 71.64,142.75 68.93,145.47 v68.93,145.82
  Bottom 0.305: v55.67,144.46 57.97,144.46 58.37,144.86 64.74,144.86 65.64,145.76 67.23,145.76 67.35,145.64 68.75,145.64 v68.93,145.82 | v29.45,146.05 25.39,146.05 v25.34,146.1
!HSYNC  (via drill 0.35 pad 0.8)
  Top 0.305: IC3.14 48.35,188.81 48.9,189.36 v48.9,201.87
  Top 0.406: R99.P$2 R102.P$2 239.39,182 236.25,185.14 236.25,237.98 233.35,240.88 178.39,240.88 176.07,238.56 166.03,238.56 165.73,238.26 54.75,238.26 47.03,230.54 47.03,208.23 47.5,207.76 48.17,207.76 48.65,208.23 48.65,208.25 v48.9,208.5
  Bottom 0.406: v48.9,201.87 v48.9,208.5
!IPL0  (via drill 0.35 pad 0.8)
  Top 0.305: IC5.19 50.25,146.11 51.22,147.07 55.38,147.07 55.59,146.87 v55.63,146.87 | v67.05,147.63 67.05,147.56 66.86,147.37 66.86,146.1 70.62,142.33 70.62,141.07 72.45,139.23 72.45,137.1 75.87,133.68 82.97,133.68 84.22,132.43 87.59,132.43 88.1,131.93 89.46,131.93 89.8,131.58 89.81,131.58 90.82,130.57 91.88,130.57 96.12,126.32 102.01,126.32 105.77,122.57 105.77,111.78 109.49,108.06 111.02,108.06 111.65,107.44 141.45,107.44 141.76,107.74 163.7,107.74 164.29,107.16 181.91,107.16 182.63,107.87 182.63,108.36 181.74,109.25 181.74,111.38 181.1,112.01 179.63,112.01 179.61,112 172.46,112 171.59,112.86 IC1.25
  Bottom 0.305: v55.63,146.87 55.57,146.81 64.01,146.81 64.51,147.31 66.39,147.31 66.71,147.63 v67.05,147.63
!IPL1  (via drill 0.35 pad 0.8)
  Top 0.305: v175.34,136.53 175.39,136.48 175.39,133.55 174.15,132.31 168.15,132.31 | v165.35,156.2 165.74,156.58 168.2,156.58 IC11.5 | v166.17,144.86 166.41,144.61 168.55,144.61 169.55,143.61 172.81,143.61 173,143.42 173.01,143.42 175.22,141.22 175.97,141.22 v176.26,140.93 | v57.92,160.95 57.52,161.35 IC5.8 | 168.15,132.31 v168.15,132.46 | 168.15,132.31 161.09,132.31 160,131.23 155.83,131.23 147.01,131.23 146.58,130.8 136.22,130.8 135.71,131.31 134.35,131.31 133.35,132.31 109.65,132.31 106.37,135.59 99.68,135.59 98.14,137.13 94.45,137.13 94.35,137.24 87.27,137.24 86.53,136.5 85.9,136.5 84.65,137.75 78.25,137.75 75.46,140.54 75.46,141.27 74.49,142.25 73.9,142.25 73.16,142.99 73.16,143.7 70.7,146.17 70.7,146.71 67.26,150.15 67.26,153.1 66.1,154.26 66.1,155.66 65.61,156.15 65.61,159.93 v65.1,160.44
  Top 0.406: IC1.24 168.11,113.57 | 168.11,113.57 168.11,110.27 R77.P$1 | 168.11,113.57 168.11,117.61 v168.15,117.65
  Bottom 0.305: v175.34,136.53 175.34,139.66 176.26,140.57 v176.26,140.93 | v165.35,156.2 165.35,145.99 165.61,145.74 165.61,145.41 v166.17,144.86 | v57.92,160.95 64.6,160.95 v65.1,160.44 | v168.15,132.46 v168.15,117.65
!IPL2  (via drill 0.35 pad 0.8)
  Top 0.406: SW1.P$4 283.95,3.75 | 283.95,3.75 SW1.P$3 | R36.P$1 283.95,21.74 | 283.95,21.74 283.95,15.22 | 283.95,15.22 283.95,3.75 | 283.95,21.74 283.95,24.59 288.09,28.73 288.09,49.69 289.97,51.56 289.97,60.45 286.16,64.26 286.16,109.47 284.55,111.08 273.56,111.08 267.61,117.03 267.61,126.83 265.51,128.93 260.25,128.93 257.44,131.74 257.44,132.5 256.87,133.07 194.35,133.07 191.52,130.25 185.07,130.25 183.64,128.82 183.64,128.81 v166.63,128.81 | IC1.23 166.51,117.55 v166.61,117.65 | 283.95,15.22 CN10.1
  Bottom 0.406: v166.63,128.81 166.61,128.79 v166.61,117.65
!IWM  (via drill 0.35 pad 0.8)
  Top 0.305: IC49.3 140.72,197.46 141.15,197.03 141.15,192.74 139.52,191.11 123.5,191.11 122.53,190.14 107.6,190.14 106.01,191.74 68.53,191.74 66.06,194.21 66.06,202.59 61.45,207.2 19.3,207.2 16.06,203.96 16.06,190.44 15.28,189.66 15.28,188.78 14.46,187.96 14.46,184.26 14.24,184.03 14.24,177.94 13.66,177.36 13.66,162.3 10.99,159.63 10.99,151.25 12.6,149.65 12.6,134.28 v12.85,134.03 | IC8.12 27.39,133.89 v27.36,133.91
  Bottom 0.305: v12.85,134.03 26.85,134.03 26.97,133.91 v27.36,133.91
!LDPS  (via drill 0.35 pad 0.8)
  Top 0.305: IC24.15 219.03,78.65 218.21,77.83 v218.21,73.1 v218.22,73.09 | IC23.15 218.69,53.65 | IC3.12 42.75,193.89 41.78,194.85 21.93,194.85 v21.89,194.82 | v220.15,26.34 219.94,26.12 218.78,26.12 218.02,26.89 204.47,26.89 203.32,28.04 198.11,28.04 193.6,32.54 175.69,32.54 174.73,33.5 161.31,33.5 159.91,34.91 115.12,34.91 113.57,36.45 76.66,36.45 59.34,19.13 22.81,19.13 9.73,32.22 9.73,48.84 7.42,51.15 7.42,68.39 8.46,69.44 8.46,85.03 9.35,85.92 9.35,88.58 8.93,89 8.93,99.82 9.86,100.75 9.86,148.51 8.15,150.22 8.15,160.67 10.92,163.44 10.92,187.42 13.67,190.16 14.2,190.16 14.94,190.91 14.94,194.45 v14.57,194.82 | v218.22,66.14 v218.22,70.87 | v220.17,45.79 220.17,47.08 218.66,48.58 218.66,53.62 218.69,53.65 | 218.69,53.65 218.69,59.85 219.11,60.26 219.11,61.41 218.8,61.71 v218.8,62.06
  Bottom 0.305: v220.15,26.34 v220.16,26.35 v220.16,45.78 v220.17,45.79 | v218.22,70.87 v218.22,73.09 | v218.8,62.06 218.22,62.64 v218.22,66.14 | v21.89,194.82 v14.57,194.82
!LDS  (via drill 0.35 pad 0.8)
  Top 0.305: IC11.35 154.81,157.31 154.81,154.76 156.17,153.41 161.21,153.41 162.12,152.5 162.12,149.63 v162.37,149.38 | v170.38,136.78 170.38,135.45 169.15,134.23 167.33,134.23 166.94,133.84 156.93,133.84 156.43,133.34 155.81,133.34 155.36,133.79 155.36,133.8 154.82,134.35 154.18,134.35 153.67,133.84 147.4,133.84 146.89,134.35 126.82,134.35 | IC2.9 41.98,163.89 42.94,162.93 57.88,162.93 v58.02,163.07 | v170.74,139.62 170.32,140.04 166.5,140.04 165.99,140.54 164,140.54 162.22,142.33 v162.18,142.33 | 126.82,134.35 v126.82,134.98 | IC1.8 128.41,121.21 v126.84,122.78 | 126.82,134.35 110.49,134.35 107.21,137.63 100.52,137.63 98.98,139.16 95.3,139.16 95.19,139.27 78.89,139.27 76.99,141.17 76.99,142.02 74.36,144.64 73.66,144.64 71.72,146.59 71.72,147.13 68.28,150.57 68.28,153.52 67.61,154.19 67.61,155.46 66.12,156.95 66.12,162.4 v65.73,162.79
  Bottom 0.305: v170.38,136.78 170.54,136.94 170.54,139.42 v170.74,139.62 | v162.37,149.38 162.18,149.19 v162.18,142.33 | v126.84,122.78 126.82,122.8 v126.82,134.98 | v65.73,162.79 65.45,163.07 v58.02,163.07
!MSE.SW  (via drill 0.35 pad 0.8)
  Top 0.305: IC46.13 195.11,179.41 195.11,194.57 193.31,196.36 189.52,196.36 182.45,203.44 144.74,203.44 141.77,200.47 141.77,192.65 139.73,190.6 123.71,190.6 122.75,189.64 107.39,189.64 105.8,191.23 68.32,191.23 65.56,194 65.56,202.38 61.24,206.69 19.51,206.69 16.57,203.75 16.57,190.23 15.79,189.45 15.79,188.56 14.97,187.75 14.97,184.05 14.74,183.82 14.74,177.72 14.17,177.15 14.17,162.09 11.5,159.42 11.5,151.61 13.11,150 13.11,134.84 13.6,134.35 13.6,133.72 12.6,132.72 12.6,112.78 13.85,111.53 13.85,99.98 12.78,98.91 12.78,75.88 11.81,74.91 11.81,52.5 13.69,50.63 13.69,33.88 24.37,23.2 57.8,23.2 75.02,40.41 115.21,40.41 116.76,38.87 161.55,38.87 162.95,37.46 176.37,37.46 177.33,36.51 195.25,36.51 199.75,32 204.96,32 206.11,30.85 230.28,30.85 236.6,24.54 239.14,24.54 v239.32,24.36
  Bottom 0.305: v239.32,24.36 239.41,24.36 R39.P$2
!OEBUFA  (via drill 0.35 pad 0.8)
  Top 0.305: IC15.P$3 198.46,211.19 199.44,212.17 199.44,225.4 198.52,226.33 v189.7,226.33 | IC11.17 169.38,188.24 169.38,191.34 170.59,192.56 170.59,197.23 170.92,197.56 v170.92,197.91 | v185.75,226.86 185.61,227.01 179.61,227.01 v179.59,226.99 | v170.97,208.57 170.97,208.64 169.17,210.44 169.17,225.49 170.01,226.33 173.51,226.33 173.99,226.81 v174.34,226.81
  Bottom 0.305: v185.75,226.86 185.95,226.66 187.89,226.66 188.47,226.08 189.1,226.08 189.35,226.33 v189.7,226.33 | v179.59,226.99 179.57,227 174.53,227 v174.34,226.81 | v170.92,197.91 170.97,197.96 v170.97,208.57
!OEBUFB  (via drill 0.35 pad 0.8)
  Top 0.305: v191.62,207.36 191.59,207.39 188.46,207.39 188.07,207.78 158.52,207.78 158.16,208.14 v158.15,208.14 | v195.05,208.18 195.16,208.28 195.16,217.16 IC15.P$6
  Top 0.406: v158.13,198.43 158.13,191 156.75,189.62 IC11.23
  Bottom 0.305: v191.62,207.36 v191.62,207.37 194.24,207.37 v195.05,208.18
  Bottom 0.406: v158.15,208.14 158.13,208.11 v158.13,198.43
!RAM  (via drill 0.35 pad 0.8)
  Top 0.305: IC8.17 31.14,121.14 25.47,121.14 23.56,123.05 23.56,138.47 23.07,138.96 23.07,152.58 23.14,152.65 | IC7.2 37.45,174.75 v29.05,174.75 | IC2.5 35.32,153.73 34.5,152.91 v32.95,152.91 | 23.14,152.65 23.14,152.98 23.61,153.45 23.61,154.16 24.54,155.09 24.54,163.69 25.55,164.7 25.55,172.48 25.91,172.84 v25.91,174.75 | 23.14,152.65 23.25,152.65 23.27,152.67 v23.36,152.67
  Bottom 0.305: v29.05,174.75 v25.91,174.75 | v32.95,152.91 32.8,152.76 23.46,152.76 v23.36,152.67
!RAMRD  (via drill 0.35 pad 0.8)
  Top 0.305: IC10.19 208.95,48.61 209.8,47.75 209.8,46.76 v209.88,46.68 | 213.87,77.22 216.53,77.22 217.17,76.58 217.17,73.13 v217.22,73.09 | IC9.1 213.81,77.16 213.87,77.22 | 213.87,77.22 212.78,77.22 211.39,78.6 IC9.19 | v217.21,70.87 v217.21,66.14 | IC10.1 214.82,45.06 217.18,45.06 217.2,45.08 217.83,45.08 218.39,45.64 218.39,47.41 217.65,48.16 217.65,60.63 v217.84,60.83 | v209.8,26.13 209.03,26.13 209.02,26.14 204.32,26.14 202.93,27.53 197.9,27.53 193.39,32.03 175.48,32.03 174.52,32.99 161.1,32.99 159.7,34.4 114.91,34.4 113.36,35.94 76.87,35.94 59.55,18.63 22.6,18.63 9.22,32.01 9.22,48.63 6.91,50.94 6.91,68.6 7.87,69.57 7.87,85.16 8.84,86.13 8.84,88.37 8.42,88.79 8.42,100.03 9.35,100.96 9.35,148.3 7.64,150.01 7.64,160.88 10.41,163.65 10.41,187.63 13.46,190.67 13.99,190.67 14.43,191.12 14.43,193.19 v13.73,193.89 | IC7.12 21.97,193.89 v21.89,193.81
  Bottom 0.305: 209.8,46.1 209.8,46.61 v209.88,46.68 | IC10.1 209.84,46.07 209.8,46.1 | v13.73,193.89 13.81,193.81 v21.89,193.81 | v217.21,70.87 217.21,72.98 217.22,72.98 v217.22,73.09 | v217.21,66.14 217.21,61.47 v217.84,60.83 | v209.8,26.13 209.8,46.1
!RAS  (via drill 0.35 pad 0.8)
  Top 0.305: v56.9,154.3 55.93,154.3 55.03,155.2 52.57,155.2 50.03,157.74 32.26,157.74 IC2.14 | v62.71,154.24 62.73,154.22 62.73,151.76 63.5,150.99 63.5,146.53 64.21,145.81 64.21,132.69 62.33,130.8 62.33,115.57 66.71,111.19 66.71,110.24 v66.81,110.14 | v65.46,100.53 65.46,100.37 66.7,99.13 69.31,99.13 72.54,95.89 72.54,71.86 71.83,71.14 R55.P$1
  Bottom 0.305: v56.9,154.3 56.96,154.24 v62.71,154.24 | v65.46,100.53 65.46,100.88 65.66,101.08 65.66,101.71 65.04,102.33 65.04,103.72 65.5,104.18 65.5,106.78 65.71,106.98 65.71,108.51 66.81,109.62 v66.81,110.14
!RASF  (via drill 0.35 pad 0.8)
  Top 0.305: IC38.4 197.84,84.7 183.9,84.7 | 183.9,84.7 168.9,84.7 | 168.9,84.7 154.1,84.7 | 154.1,84.7 138.7,84.7 | 138.7,84.7 123.8,84.7 | 123.8,84.7 119.8,84.7 | 119.8,84.7 108.8,84.7 | 108.8,84.7 95.58,84.7 94.61,83.73 IC25.4 | IC29.4 108.81,84.69 108.8,84.7 | IC33.4 123.81,84.69 123.8,84.7 | IC37.4 138.81,84.59 138.7,84.7 | IC26.4 153.81,84.41 154.1,84.7 | IC30.4 168.81,84.61 168.9,84.7 | IC34.4 183.81,84.61 183.9,84.7 | 183.9,57.77 168.66,57.77 | 168.66,57.77 153.92,57.77 | 153.92,57.77 138.81,57.77 | 138.81,57.77 123.83,57.77 | 123.83,57.77 119.8,57.77 | 119.8,57.77 108.84,57.77 | 108.84,57.77 93.85,57.77 | IC27.4 93.81,57.81 93.85,57.77 | IC31.4 108.81,57.79 108.84,57.77 | IC35.4 123.81,57.78 123.83,57.77 | IC39.4 138.81,57.77 | IC28.4 153.81,57.88 153.92,57.77 | IC32.4 168.81,57.92 168.66,57.77 | IC36.4 183.81,57.85 183.9,57.77 | IC40.4 197.84,57.77 183.9,57.77 | R55.P$2 79.23,71.14 79.93,70.44 79.93,62.01 84.17,57.77 93.85,57.77 | v119.8,58.7 119.8,57.77 | v119.77,76.2 119.77,71.69 v119.7,71.62 | 119.8,84.7 119.8,83.83 120.02,83.61 v120.02,83.5
  Bottom 0.305: v119.7,71.62 119.8,71.53 v119.8,58.7 | v120.02,83.5 120.02,76.45 v119.77,76.2
!RES  (via drill 0.35 pad 0.8)
  Top 0.305: IC46.34 178.89,161.68 179.71,160.87 179.71,148.58 182.63,145.66 189.3,145.66 194.52,140.44 201.21,140.44 205.36,136.29 205.36,133.68
  Top 0.406: R33.P$1 273.03,132.46 268.73,132.46 | 268.73,132.46 261.24,132.46 | IC1.17 152.53,113.57 | 152.53,113.57 IC1.18 | IC4.7 261.19,132.51 261.24,132.46 | IC4.2 268.81,132.54 268.73,132.46 | 261.24,132.46 260.19,132.46 259.07,133.58 257.22,133.58 257.12,133.68 205.36,133.68 194.09,133.68 191.27,130.85 184.81,130.85 183.58,129.62 162.06,129.62 161.04,128.6 151.38,128.6 v151.19,128.4 | 152.53,113.57 152.53,117.57 v152.35,117.75
  Bottom 0.406: v151.19,128.4 152.35,127.24 v152.35,117.75
!ROM  (via drill 0.35 pad 0.8)
  Top 0.305: 59.83,178.67 v59.33,178.67 | IC7.3 41.73,178.65 42.78,179.71 59.56,179.71 59.83,179.44 59.83,178.67 | 38.81,157.24 49.82,157.24 52.36,154.69 54.82,154.69 56.03,153.48 56.03,152.17 56.48,151.73 57.1,151.73 57.54,152.17 57.54,153.16 59.3,154.91 59.3,162.91 59.81,163.42 59.81,167.53 59.77,167.57 59.77,172.59 59.31,173.04 59.31,175.38 59.83,175.9 59.83,178.67 | IC2.6 38.81,157.24 | IC8.16 34.83,123.73 35.27,124.17 35.27,125.74 35.09,125.92 35.09,126.28 34.76,126.61 34.76,139.96 33.09,141.63 29.49,141.63 28.18,142.93 28.18,152.26 29.11,153.19 29.11,156.67 29.67,157.24 38.81,157.24 | v67.71,178.79 67.46,179.04 67.46,183.74 71.35,187.63 74.47,187.63 v75.18,186.92 | v75.2,194.84 75.2,195.88 75.81,196.49 92.52,196.49 93.5,197.47 97.64,197.47 99.28,195.83 102.8,195.83 103.66,194.98 105.16,194.98 105.18,194.96 110.56,194.96 111.07,194.45 115.06,194.45 118.08,197.47 126.09,197.47 128.65,200.03 128.65,202.95 129.54,203.84 131.92,203.84 132.76,204.68 132.76,206.68 131.82,207.62 IC49.8
  Bottom 0.305: v59.33,178.67 67.59,178.67 v67.71,178.79 | v75.2,194.84 75.18,194.82 v75.18,186.92
!ROM_OE  (via drill 0.35 pad 0.8)
  Top 0.305: IC42.24 126.31,167.34 102.38,167.34 | 102.38,167.34 IC41.24 | 102.38,167.34 100.53,167.34 99.86,166.66 99.86,164.44 98.07,162.65 98.07,158.52 97.4,157.86 97.4,154.64 96.81,154.04 v96.81,153.93 | IC45.12 84.92,112.46 84.23,113.15 84.23,126.2 85.81,127.77 87.15,127.77 v87.3,127.92
  Bottom 0.305: v87.3,127.92 87.59,128.21 87.59,128.26 94.95,135.62 95.35,135.62 95.8,136.06 95.8,136.69 96.54,137.43 96.54,148.28 97.03,148.77 97.03,151.35 96.4,151.98 96.4,153.52 v96.81,153.93
!RTC
  Top 0.406: IC46.12 192.65,174.38 193.85,173.18 195.64,173.18 200.76,173.18 IC47.5
!SCC.WREQ  (via drill 0.35 pad 0.8)
  Top 0.305: 169.29,169.29 169.29,169.8 168.5,170.59 166.8,170.59 165.55,171.84 155.43,171.84 IC11.30 | 169.29,169.29 169.29,167.91 v169.27,167.89 | IC11.10 169.28,169.3 169.29,169.29
  Top 0.406: v175,167.78 175.19,167.97 178.06,167.97 179.83,166.2 192.06,166.2 IC46.9
  Bottom 0.305: v175,167.78 174.88,167.89 v169.27,167.89
!SCCEN  (via drill 0.35 pad 0.8)
  Top 0.305: IC11.33 151.38,164.22 150.43,165.16 150.43,170.52 150.81,170.9 150.81,172.76 149.93,173.64 149.93,180.31 145.55,184.69 145.55,186.39 v145.14,186.81 | IC8.14 30.63,129.37 27.86,129.37 25.08,132.15 25.08,139.1 24.59,139.59 24.59,151.19 25.13,151.73 25.13,153.53 26.06,154.45 26.06,163.05 27.07,164.07 27.07,171.85 27.78,172.56 27.78,175.45 29.41,177.07 57.97,177.07 v58.05,177.15 | v142.62,189.55 142.46,189.55 140.97,188.06 124.76,188.06 123.8,187.1 106.34,187.1 104.74,188.69 67.77,188.69 66.44,187.35 66.44,177.55 66.72,177.27 v66.72,177.12
  Bottom 0.305: v142.62,189.55 145.14,187.03 v145.14,186.81 | v66.72,177.12 66.69,177.15 v58.05,177.15
!SCCRD  (via drill 0.35 pad 0.8)
  Top 0.305: v157.48,156.59 156.84,157.23 156.84,170.94 v156.72,171.07 | v156.72,173.1 156.72,175.01 155.96,175.76 152.5,175.76 151.46,176.81 151.46,180.94 147.07,185.32 147.07,187.37 145.84,188.61 145.84,198.44 v146.22,198.82 | v58.78,168.66 58.65,168.53 29.9,168.53 29.11,167.74 29.11,163.23 28.09,162.21 28.09,153.61 27.16,152.69 27.16,145.41 26.61,144.86 26.61,132.78 28.04,131.35 IC8.13 | v59.52,197.17 v59.5,197.17 58.84,196.51 58.84,192.09 62.37,188.56 62.37,175 63.08,174.3 63.08,168.96 v63.06,168.94 | v68.04,197.31 72.61,197.31 73.82,198.52 91.67,198.52 92.66,199.5 98.48,199.5 100.07,197.91 102.38,197.91 v102.62,198.15 | v111.27,200.55 110.62,201.2 110.62,206.25 111.63,207.26 124.46,207.26 125.73,208.53 125.73,211.41 127.76,213.44 141.26,213.44 145.39,209.31 145.39,208.07 v146.13,207.33 | v109.6,199.22 109.55,199.22 109.25,199.51 103.12,199.51 v102.87,199.76
  Bottom 0.305: IC11.36 v157.47,156.6 v157.48,156.59 | v156.72,173.1 v156.72,171.07 | v58.78,168.66 62.82,168.66 63.06,168.9 v63.06,168.94 | v68.04,197.31 67.9,197.17 v59.52,197.17 | v111.27,200.55 109.94,199.22 v109.6,199.22 | v102.87,199.76 102.87,198.4 v102.62,198.15 | v146.22,198.82 146.13,198.91 v146.13,207.33
!SERVID  (via drill 0.35 pad 0.8)
  Top 0.305: IC23.13 219.78,58.73 219.62,58.9 219.62,62.32 219.11,62.82 218.49,62.82 218.04,62.38 218.04,61.7 218.6,61.15 218.6,60.47 218.15,60.02 218.15,48.37 219.16,47.37 v219.16,45.52 v219.15,45.51 | v219.09,26.89 218.74,26.89 218.23,27.39 204.68,27.39 203.53,28.54 198.32,28.54 193.81,33.05 175.9,33.05 174.94,34.01 161.52,34.01 160.12,35.41 115.33,35.41 113.78,36.96 76.45,36.96 59.13,19.64 23.02,19.64 10.23,32.43 10.23,49.05 7.92,51.36 7.92,68.18 8.97,69.22 8.97,84.44 9.86,85.33 9.86,88.79 9.44,89.21 9.44,99.61 10.36,100.54 10.36,148.72 8.66,150.43 8.66,160.46 11.43,163.23 11.43,178.64 v11.75,178.96 | IC7.18 28.91,178.65 28.52,178.26 v28.39,178.26
  Bottom 0.305: v219.15,45.51 219.15,26.95 v219.09,26.89 | v28.39,178.26 28.39,178.13 27.73,177.47 26.59,177.47 25.93,178.14 12.58,178.14 v11.75,178.96
!SND  (via drill 0.35 pad 0.8)
  Top 0.305: 90.8,117.54 90.8,110.11 91.95,108.95 99.64,108.95 100.17,109.48 100.96,109.48 101.4,109.03 v101.53,109.03 | IC45.10 90.8,117.54 | IC44.13 103.43,195.92 103.01,196.34 99.49,196.34 97.85,197.98 93.29,197.98 92.31,196.99 74.51,196.99 73.2,195.68 v73.2,194.53 | 90.8,117.54 90.8,127.09 91.53,127.81 91.53,128.5 91.08,128.94 90.15,128.94 89.13,129.96 89.12,129.96 88.78,130.3 87.43,130.3 86.92,130.81 83.54,130.81 82.29,132.06 75.2,132.06 70.83,136.42 70.83,137.64 v70.58,137.89 | v74.13,156.15 73.45,156.15 71.88,157.72 71.88,158.59 70.69,159.78 70.69,162.66 71.7,163.67 71.7,165.06 69.47,167.29 69.47,178.76 69.48,178.77 69.48,183.57 69.7,183.79 70.15,184.24 71.77,185.86 v73.26,185.86
  Top 0.406: IC50.7 241.34,91.35 | 241.34,91.35 241.34,95.67 241.97,96.3 v245.1,96.3 | v241.53,74.74 240.95,74.16 240.95,70.8 v241.23,70.52 | 241.34,91.35 241.34,81.75 v241.48,81.62 | v249.17,100.2 249.17,100.23 249.4,100.45 249.4,101.38 248.98,101.79 247.59,101.79 243.88,105.49 204.95,105.49 204.92,105.52 186.83,105.52 185.78,104.46 163.17,104.46 162.59,105.05 142.87,105.05 142.57,104.74 110.53,104.74 110.01,105.26 106.31,105.26 105.4,106.17 v105.4,108.92
  Bottom 0.305: v73.26,185.86 73.26,194.22 73.2,194.28 v73.2,194.53 | v70.58,137.89 73.44,140.75 73.44,155 74.13,155.69 v74.13,156.15
  Bottom 0.406: IC51.7 242.17,66.35 241.46,67.06 241.46,68.76 241.59,68.88 241.59,69.89 241.23,70.24 v241.23,70.52 | v241.53,74.74 241.54,74.75 241.54,80.91 241.48,80.97 v241.48,81.62 | v245.1,96.3 245.1,96.36 248.94,100.2 v249.17,100.2 | v105.4,108.92 101.64,108.92 v101.53,109.03
!SNDPG  (via drill 0.35 pad 0.8)
  Top 0.305: IC46.5 191.25,156.6 190.37,157.48 v190.37,163.33 | IC13.5 37.45,74.27 36.92,73.73 v36.53,73.73 | v25.65,82.04 25.65,76.45 26.87,75.23 32.2,75.23 32.77,74.67 32.77,73.77 v32.06,73.06 | IC12.5 36.65,99.27 35.69,98.31 24.57,98.31 24.56,98.3 | IC12.11 24.61,101.81 24.56,101.85 | v190.3,167 189.66,167.64 189.66,183.07 v189.6,183.13 | v193.34,183.27 192.26,183.27 190.45,185.08 190.45,191.13 181.19,200.39 146,200.39 144.82,199.21 144.82,189.97 141.9,187.05 125.19,187.05 124.22,186.08 105.92,186.08 104.32,187.67 77.01,187.67 75.5,186.16 74.87,186.16 73.91,187.12 71.56,187.12 68.22,183.78 v68.22,180.97 | v59.54,180.46 59.54,180.45 59.31,180.21 42.58,180.21 41.98,179.62 28.75,179.62 28.34,180.02 26.54,180.02 25.79,179.27 25.79,175.71 25.04,174.96 25.04,164.91 24.03,163.9 24.03,155.29 23.1,154.37 23.1,153.66 22.56,153.12 22.56,138.75 23.05,138.26 23.05,122.84 24.52,121.38 24.52,111.91 24.56,111.87 24.56,101.85 | 24.56,94.11 24.56,85.55 v25.65,84.45 | 24.56,94.11 24.56,98.3 | 24.56,98.3 24.56,101.85 | IC12.14 24.64,94.19 24.56,94.11
  Bottom 0.305: v25.65,84.45 v25.65,82.04 | v190.37,163.33 190.3,163.41 v190.3,167 | v189.6,183.13 189.74,183.27 v193.34,183.27 | v68.22,180.97 60.08,180.97 59.57,180.46 v59.54,180.46 | v32.06,73.06 35.84,73.06 36.52,73.73 v36.53,73.73
!SNDRES  (via drill 0.35 pad 0.8)
  Top 0.305: IC51.1 240.61,51.11 239.65,52.07 v239.65,66.36 | IC50.10 238.85,91.35 239.47,90.73 v239.47,81.66 | v239.66,76.42 239.78,76.29 239.78,76.11 | 239.78,76.11 IC50.1 | 239.78,76.11 239.78,68.94 v239.74,68.91
  Bottom 0.305: v239.66,76.42 239.52,76.56 239.52,81.61 v239.47,81.66 | v239.74,68.91 239.65,68.81 v239.65,66.36
!UDS  (via drill 0.35 pad 0.8)
  Top 0.305: IC2.8 36.26,161.35 34.92,162.69 30.42,162.69 29.61,163.49 29.61,164.29 30.79,165.47 47.35,165.47 49.4,167.51 58.92,167.51 v58.98,167.57 | IC1.7 125.87,111.71 124.78,110.62 123.46,110.62 121.8,108.96 112.28,108.96 111.66,109.58 110.12,109.58 107.29,112.41 107.29,123.2 102.64,127.85 96.75,127.85 92.51,132.09 91.45,132.09 90.44,133.11 90.43,133.11 90.09,133.45 88.73,133.45 88.23,133.96 84.85,133.96 83.6,135.21 76.5,135.21 73.98,137.73 73.98,139.87 72.15,141.7 72.15,142.97 69.68,145.43 69.68,146.28 66.24,149.72 66.24,152.68 65.09,153.84 65.09,155.24 64.1,156.23 64.1,160.51 64.97,161.38 64.97,162.99 64.79,163.18 64.79,167.39 v64.65,167.53
  Bottom 0.305: v64.65,167.53 64.6,167.57 v58.98,167.57
!VCA  (via drill 0.35 pad 0.8)
  Top 0.305: IC7.15 24.34,186.27 23.76,185.68 23.76,184.78 23.67,184.69 23.67,180.12 v23.92,179.87 | IC8.4 33.16,121.19 32.15,122.21 25.12,122.21 24.07,123.26 24.07,138.68 23.57,139.18 23.57,151.65 24.12,152.19 24.12,153.95 25.04,154.87 25.04,163.47 26.06,164.49 26.06,172.27 26.66,172.88 26.66,178.01 26.63,178.04 26.63,179.04 v26.86,179.27
  Bottom 0.305: v26.86,179.27 26.25,179.87 v23.92,179.87
!VIAIRQ  (via drill 0.35 pad 0.8)
  Top 0.305: v177.42,199.63 177.17,199.88 146.21,199.88 145.33,199 145.33,189.76 142.11,186.54 125.39,186.54 124.43,185.57 105.71,185.57 104.11,187.17 78.2,187.17 76.69,185.65 74.66,185.65 73.7,186.61 71.81,186.61 68.73,183.53 68.73,181.54 68.97,181.29 68.97,178.98 68.96,178.97 68.96,167.08 70.94,165.1 v70.94,163.98 | IC5.9 58.46,163.89 v58.54,163.97
  Bottom 0.305: v70.94,163.98 58.58,163.98 58.57,163.97 v58.54,163.97 | IC46.21 177.42,194.74 v177.42,199.63
!VIDOUT  (via drill 0.35 pad 0.8)
  Top 0.406: R101.P$2 R104.P$2 239.56,185 236.85,187.71 236.85,238.23 233.6,241.49 178.14,241.49 175.82,239.17 165.78,239.17 165.48,238.87 54.5,238.87 46.35,230.73 46.35,208.28 45.89,207.82 19.12,207.82 15.5,204.19 15.5,190.67 14.72,189.89 14.72,189.01 13.9,188.19 13.9,184.77 v13.54,184.41 | IC7.16 31.11,183.81 v24.94,183.81
  Bottom 0.406: v24.94,183.81 14.14,183.81 v13.54,184.41
!VIDPG  (via drill 0.35 pad 0.8)
  Top 0.406: v258.21,134.38 206.62,134.38 206.04,134.96 206.04,136.4 201.44,141 194.75,141 189.48,146.26 189.48,163.59 190.12,164.22 IC46.8 | v258.31,132.33 258.31,131.73 260.51,129.54 265.77,129.54 268.22,127.08 268.22,117.28 273.82,111.69 284.8,111.69 287.02,109.47 287.02,64.26 290.58,60.7 290.58,51.31 288.8,49.53 288.8,48.35 v288.89,48.26 | IC21.4 58.58,46.73 v58.68,46.83 | v277.51,48.26 276.58,47.33 263.79,47.33 260.79,44.33 249.79,44.33 243.42,37.96 236.17,37.96 235.3,37.1 208.7,37.1 207.55,38.25 202.34,38.25 197.83,42.75 179.92,42.75 178.96,43.71 165.54,43.71 164.14,45.12 119.35,45.12 117.8,46.66 72.43,46.66 55.21,29.45 26.95,29.45 20.49,35.91 20.49,43.66 22.03,45.2 27.68,45.2 29.06,43.82 29.06,41.02 29.95,40.13 32.22,40.13 34.76,37.59 40.09,37.59 40.87,38.37 41.54,38.37 42.83,37.08 56.38,37.08 60.12,40.82 60.12,46.5 v60.32,46.7
  Bottom 0.406: v258.31,132.33 258.21,132.43 v258.21,134.38 | v288.89,48.26 279.52,48.26 v277.51,48.26 | v58.68,46.83 58.81,46.7 v60.32,46.7
!VMA  (via drill 0.35 pad 0.8)
  Top 0.305: IC46.23 177.17,189.62 174.45,186.89 174.45,177.82 170.03,173.4 170.03,161.85 168.47,160.3 165.4,160.3 161.57,156.46 v159.28,156.46 | v159.37,145.87 159.58,145.66 163.54,145.66 165.61,143.59 167.72,143.59 v167.98,143.33 | v167.77,135.38 166.73,134.35 156.42,134.35 156.17,134.1 v156.12,134.1 | IC1.19 156.35,117.8 v156.62,118.07
  Bottom 0.305: v167.98,143.33 167.77,143.12 v167.77,135.38 | v159.37,145.87 159.28,145.97 v159.28,156.46 | v156.62,118.07 156.55,118.14 156.55,133.49 156.12,133.92 v156.12,134.1
!VPA  (via drill 0.35 pad 0.8)
  Top 0.305: IC5.2 50.97,146.11 50.01,145.15 45.18,145.15 44.22,146.11 41.5,146.11 39.93,147.69 37.8,147.69 35.36,150.12 29.97,150.12 28.69,148.84 28.69,143.14 29.7,142.13 33.3,142.13 35.27,140.17 35.27,126.82 v35.85,126.24 | IC1.21 160.87,113.57 159.29,112 149.89,112 147.6,109.7 143,109.7 141.24,107.94 111.86,107.94 111.23,108.57 109.7,108.57 106.27,111.99 106.27,122.78 102.22,126.83 96.33,126.83 92.09,131.07 91.03,131.07 90.02,132.09 90.01,132.09 89.67,132.43 88.31,132.43 87.81,132.94 84.43,132.94 83.18,134.19 76.08,134.19 72.96,137.31 72.96,139.44 71.13,141.28 71.13,142.54 67.87,145.8 v67.87,147.03
  Bottom 0.305: IC8.15 35.78,126.27 35.81,126.24 v35.85,126.24 | IC5.2 64.55,146.11 65.22,146.78 67.63,146.78 v67.87,147.03
!VSYNC  (via drill 0.35 pad 0.8)
  Top 0.305: IC3.13 47.46,191.35 47.88,191.77 v47.88,201.87 | v206.85,136.02 241.69,136.02 243.71,138.05 v243.71,139.43 | 243.71,147.19 v243.71,147.16 | v202.37,136.06 202.31,136.06 199.96,138.41 193.68,138.41 188.46,143.63 181.79,143.63 178.97,146.44 IC46.40
  Top 0.406: R100.P$2 R103.P$2 235.63,179 | 235.63,179 235.63,237.72 233.16,240.21 178.58,240.21 176.32,237.95 166.28,237.95 165.99,237.65 55,237.65 47.84,230.49 v47.84,208.57 | 235.63,179 235.63,150.57 239.01,147.19 243.71,147.19
  Bottom 0.305: v202.37,136.06 202.41,136.02 v206.85,136.02 | v243.71,147.16 v243.71,139.43